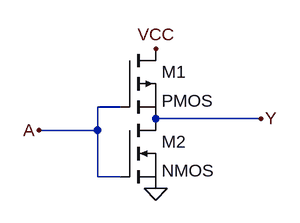
[diagram p0: schematic NOT.asc]
NOT.asc, the LTspice schematic file:
Version 4
SHEET 1 880 680
WIRE 0 160 -32 160
WIRE 192 176 48 176
WIRE -32 192 -32 160
WIRE -32 192 -112 192
WIRE -32 256 -32 192
WIRE 0 256 -32 256
FLAG 48 80 VCC
FLAG 48 272 0
FLAG -112 192 A
FLAG 192 176 Y
SYMBOL pmos 0 80 R0
SYMATTR InstName M1
SYMBOL nmos 0 176 R0
SYMATTR InstName M2

The netlist it stands for:
* NOT.asc
M1 VCC A Y Y PMOS
M2 Y A 0 0 NMOS
.model NMOS NMOS
.model PMOS PMOS
.lib standard.mos
.backanno
.end